# EAGLE design Relay ISOx16 (EAGLE 6.2)
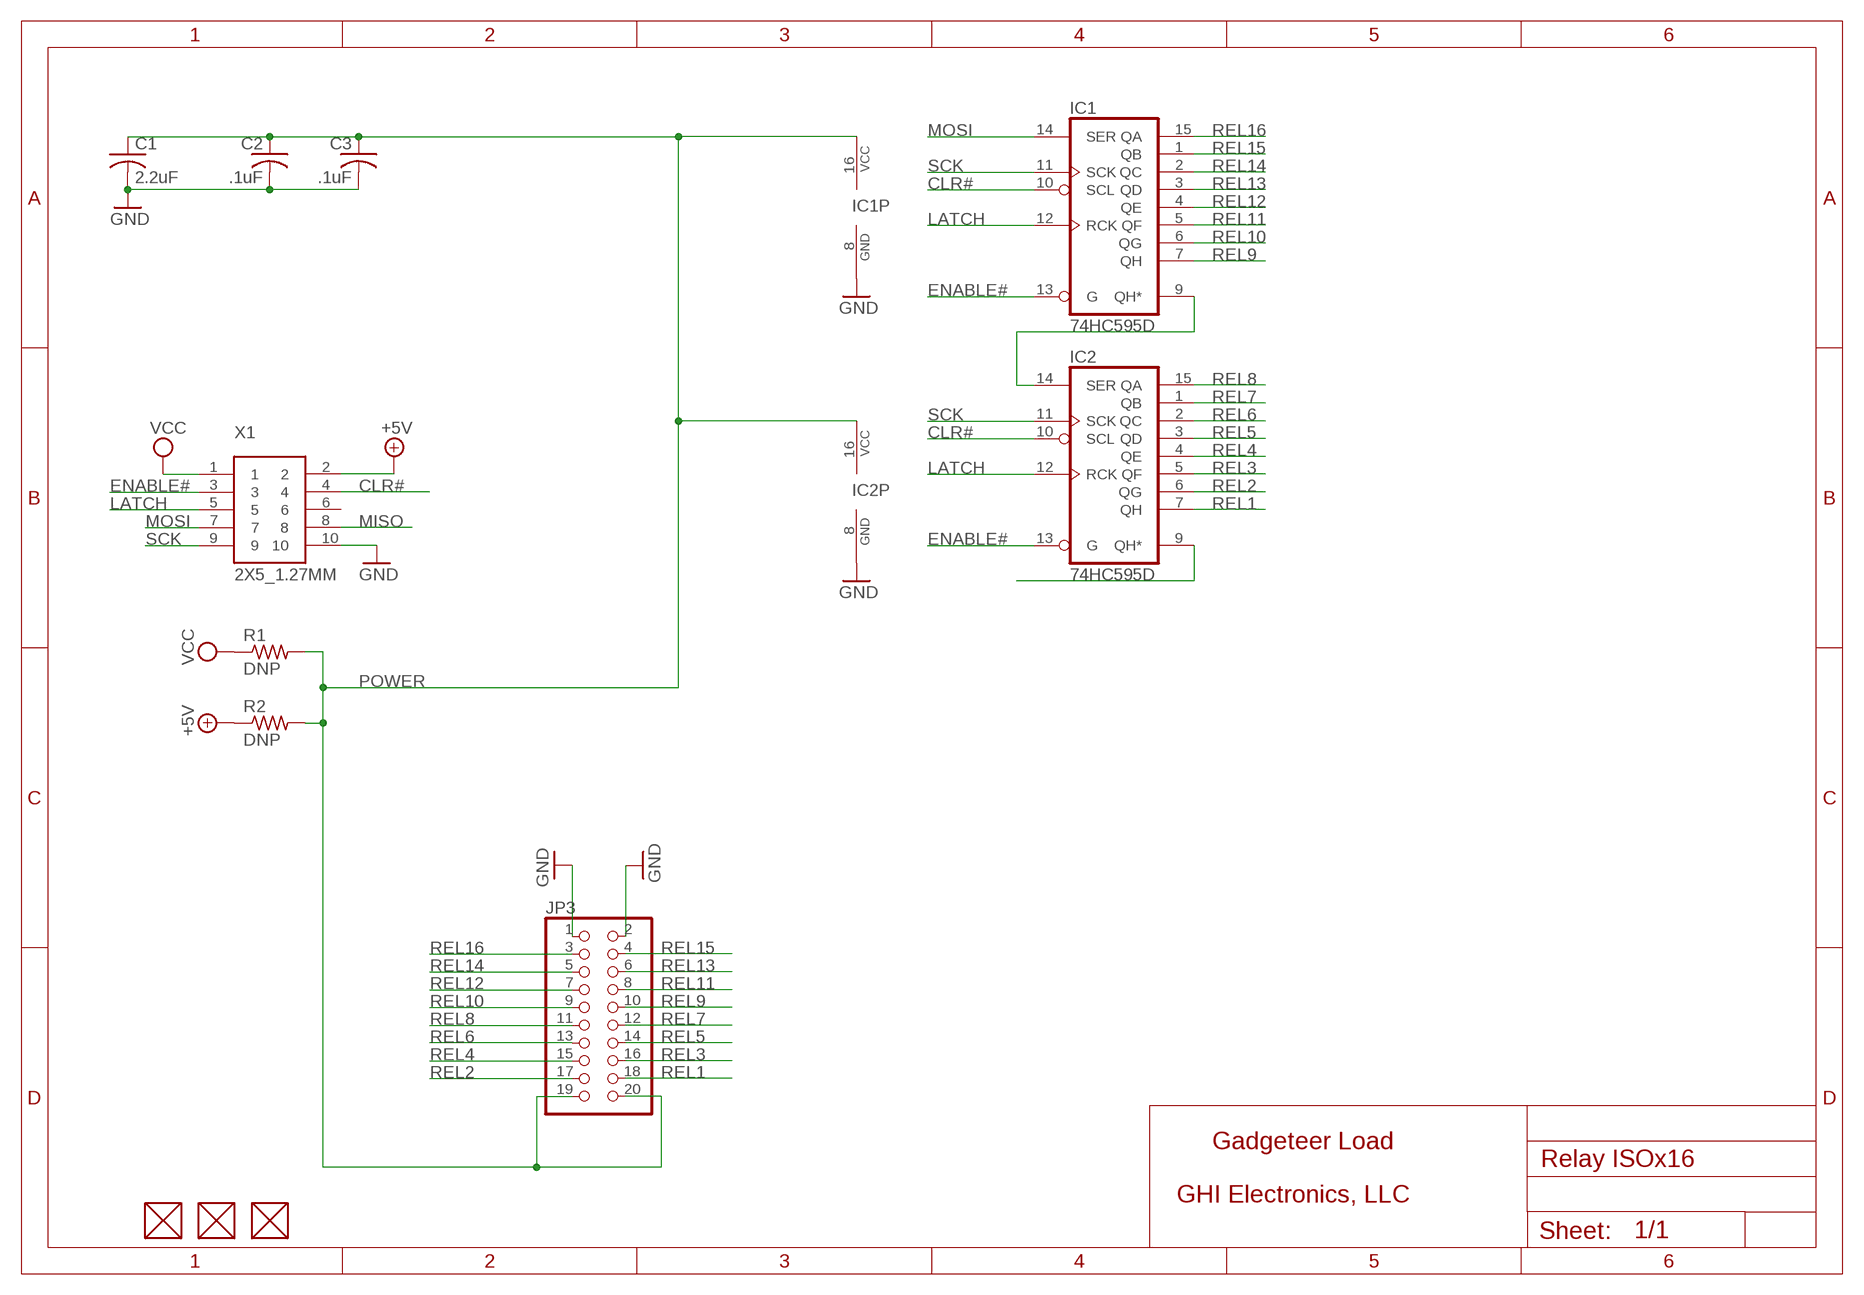
[diagram p0: schematic, sheet 1]

## Parts
C1  2.2uF  C-USC0805K  [C0805K]
C2  .1uF  C-USC0603K  [C0603K]
C3  .1uF  C-USC0603K  [C0603K]
FUD1  FIDUCIAL  [FIDUCIAL_40MIL]
FUD2  FIDUCIAL  [FIDUCIAL_40MIL]
FUD3  FIDUCIAL  [FIDUCIAL_40MIL]
IC1  74HC595D  74LS595D  [SO16]
IC2  74HC595D  74LS595D  [SO16]
JP3  PINHD-2X10  [2X10]
R1  DNP  R-US_R0603  [R0603]
R2  DNP  R-US_R0603  [R0603]
X1  2X5_1.27MM  [2X5_1.27MM]

## Nets
+5V [power]: R2.1 X1.2
CLR#: IC1.10(SCL) IC2.10(SCL) X1.4
ENABLE#: IC1.13(G) IC2.13(G) X1.3
GND [power]: C1.2 C2.2 C3.2 IC1.8(GND) IC2.8(GND) JP3.1 JP3.2 X1.10
LATCH: IC1.12(RCK) IC2.12(RCK) X1.5
MISO: X1.8
MOSI: IC1.14(SER) X1.7
N$24: IC1.9(QH*) IC2.14(SER)
N$25: IC2.9(QH*)
POWER: C1.1 C2.1 C3.1 IC1.16(VCC) IC2.16(VCC) JP3.19 JP3.20 R1.2 R2.2
REL1: IC2.7(QH) JP3.18
REL2: IC2.6(QG) JP3.17
REL3: IC2.5(QF) JP3.16
REL4: IC2.4(QE) JP3.15
REL5: IC2.3(QD) JP3.14
REL6: IC2.2(QC) JP3.13
REL7: IC2.1(QB) JP3.12
REL8: IC2.15(QA) JP3.11
REL9: IC1.7(QH) JP3.10
REL10: IC1.6(QG) JP3.9
REL11: IC1.5(QF) JP3.8
REL12: IC1.4(QE) JP3.7
REL13: IC1.3(QD) JP3.6
REL14: IC1.2(QC) JP3.5
REL15: IC1.1(QB) JP3.4
REL16: IC1.15(QA) JP3.3
SCK: IC1.11(SCK) IC2.11(SCK) X1.9
VCC [power]: R1.1 X1.1
Unconnected: FUD1.P$1 FUD2.P$1 FUD3.P$1 X1.6

## Notes on the sheet
- Gadgeteer Load
- GHI Electronics, LLC

## Library data of the parts
C1-C3 = rcl:C-US: CAPACITOR, American symbol
FUD1-FUD3 = GHI:FIDUCIAL
IC1 IC2 = 74xx-us:74*595: 8-bit SHIFT REGISTER, output latch
JP3 = pinhead:PINHD-2X10: PIN HEADER
R1 R2 = rcl:R-US_: RESISTOR, American symbol
X1 = GHI:2X5_1.27MM

## Board
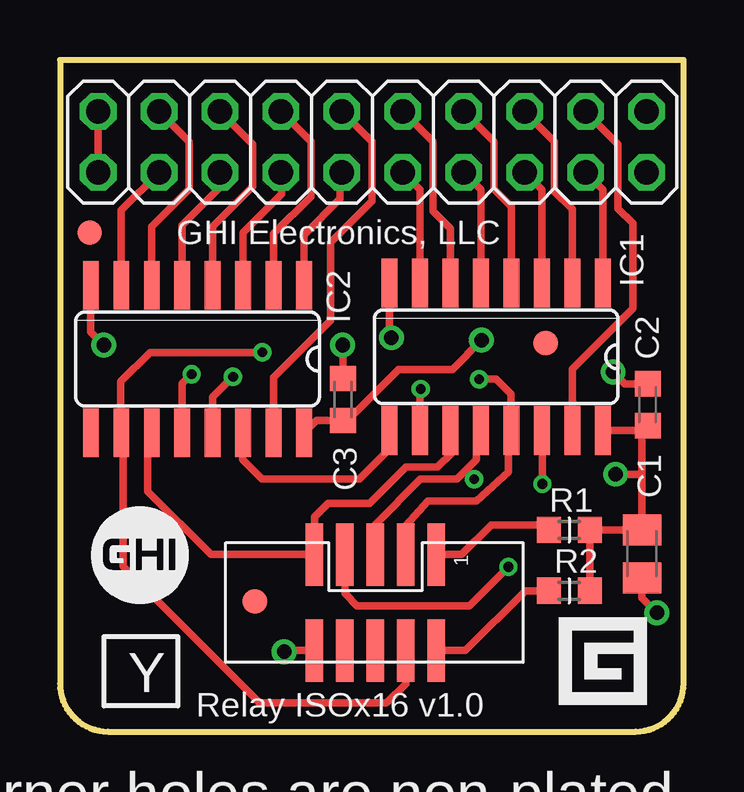
[diagram p1: board, top side]
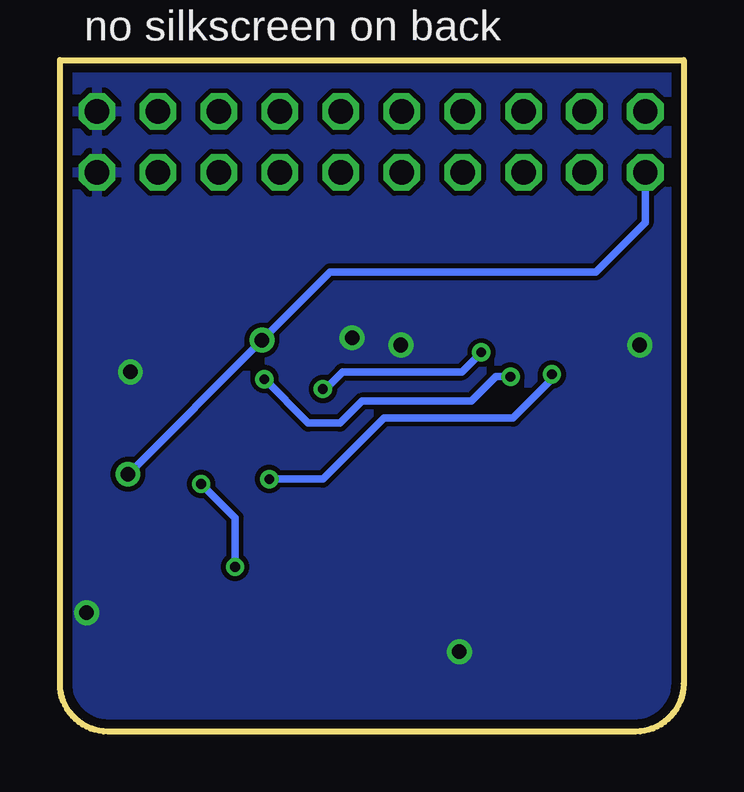
[diagram p2: board, bottom side, seen from below]

Size 26 x 28 mm. Coordinates in mm from the lower left corner, seen from the top.
Outline: 26,28 0,28 0,2 arc90 2,0 24,0 arc90 26,2 26,28
Copper layers (1+16): Top 0.035mm / dielectric 1.5mm / Bottom 0.035mm
Design rules: minimum track width 8mil, minimum drill 12mil, track to track 8mil, track to pad 8mil, pad to pad 8mil, via to via 8mil, smd to smd 8mil, copper to edge 15mil, drill to drill 8mil, minimum pad ring 10mil, minimum via ring 7mil, stop-mask expansion 4mil, vias tented up to drill 50mil, thermal gap 10mil

### Footprints (pad centres in the part's own frame; a part is rotated, then mirrored left to right if it is on the bottom)
C0805K = smd 1.3 x 1.6: 1 -1,0; 2 1,0
C0603K = smd 1.05 x 1.08: 1 -0.875,0; 2 0.875,0
FIDUCIAL_40MIL = smd 1.016 x 1.016: P$1 0,0
SO16 = smd 0.66 x 2.032: 1 -4.445,-3.073; 2 -3.175,-3.073; 3 -1.905,-3.073; 4 -0.635,-3.073; 5 0.635,-3.073; 6 1.905,-3.073; 7 3.175,-3.073; 8 4.445,-3.073; 9 4.445,3.073; 10 3.175,3.073; 11 1.905,3.073; 12 0.635,3.073; 13 -0.635,3.073; 14 -1.905,3.073; 15 -3.175,3.073; 16 -4.445,3.073
2X10 = drill 1.016 octagon: 1 -11.43,-1.27; 2 -11.43,1.27; 3 -8.89,-1.27; 4 -8.89,1.27; 5 -6.35,-1.27; 6 -6.35,1.27; 7 -3.81,-1.27; 8 -3.81,1.27; 9 -1.27,-1.27; 10 -1.27,1.27; 11 1.27,-1.27; 12 1.27,1.27; 13 3.81,-1.27; 14 3.81,1.27; 15 6.35,-1.27; 16 6.35,1.27; 17 8.89,-1.27; 18 8.89,1.27; 19 11.43,-1.27; 20 11.43,1.27
R0603 = smd 1 x 1.1: 1 -0.85,0; 2 0.85,0
2X5_1.27MM = smd 2.6 x 0.74: 1 -2,2.58; 2 2,2.58; 3 -2,1.31; 4 2,1.31; 5 -2,0.04; 6 2,0.04; 7 -2,-1.23; 8 2,-1.23; 9 -2,-2.5; 10 2,-2.5

### Placement (x,y rotation side)
C1  24.27,7.41 270 top
C2  24.5,13.62 90 top
C3  11.8,13.84 90 top
FUD1  20.25,16.19 270 top
FUD2  1.25,20.8 0 top
FUD3  8.12,5.43 0 top
IC1  18.19,15.63 180 top
IC2  5.74,15.53 180 top
JP3  13.02,24.58 180 top
R1  21.23,8.41 0 top
R2  21.23,5.87 0 top
X1  13.11,5.38 270 top

### Tracks (layer width: path | path; a pad name or v marks a point on that pad's centre or on a via)
+5V
  Top 0.305: X1.2 16.91,3.38 19.41,5.87 R2.1
CLR#  (via drill 0.41)
  Top 0.305: X1.4 14.42,2 13.61,1.19 8.33,1.19 2.64,6.88 2.64,12.38 IC2.10 2.54,12.48 2.54,14.59 3.76,15.81 v8.43,15.81 | IC1.10 15.01,14.26 v15.04,14.28
  Bottom 0.305: v15.04,14.28 14.94,14.28 14.22,14.99 9.25,14.99 v8.43,15.81
ENABLE#  (via drill 0.41)
  Top 0.305: X1.3 14.42,8.58 15.34,9.61 17.37,9.61 18.69,10.83 18.69,12.42 IC1.13 18.8,12.58 18.8,14.08 18.19,14.69 v17.48,14.69 | IC2.13 6.37,13.95 v7.21,14.79
  Bottom 0.305: v7.21,14.79 7.82,14.79 8.84,13.78 13.41,13.78 14.33,12.86 15.65,12.86 v17.48,14.69
GND  (via drill 0.61)
  Top 0.305: C1.2 24.27,5.58 v24.89,4.95 | C2.2 23.56,14.5 v23.06,14.99 | IC1.8 13.74,16.49 v13.82,16.42 | C3.2 11.8,15.79 v11.79,16.11 | X1.10 9.4,3.38 v9.35,3.33 | IC2.8 1.29,16.65 v1.83,16.11
  pour Bottom: 26.32,-0.07 26.32,27.9 -0.41,27.9 -0.41,-0.07
LATCH  (via drill 0.41)
  Top 0.305: X1.5 13.15,8.63 15.04,10.53 16.56,10.53 16.92,10.88 | 16.92,10.88 17.37,11.34 17.37,12.37 IC1.12 | IC2.12 5.1,14.51 v5.49,14.89 | v17.27,10.53 16.92,10.88
  Bottom 0.305: v5.49,14.89 5.49,14.69 7.11,13.06 12.5,13.06 15.04,10.53 v17.27,10.53
MOSI  (via drill 0.41)
  Top 0.305: X1.7 11.88,5.76 12.39,5.24 17.07,5.24 v18.69,6.87 | v20.12,10.32 20.12,12.53 IC1.14
  Bottom 0.305: v18.69,6.87 18.69,8.9 v20.12,10.32
N$24
  Top 0.305: IC1.9 13.74,11.77 12.5,10.53 8.43,10.53 7.62,11.34 7.62,12.44 IC2.14
POWER  (via drill 0.61)
  Top 0.305: R2.2 R1.2 24.17,8.41 C1.1 24.27,10.63 | IC1.16 24.31,12.55 C2.1 24.27,12.51 24.27,10.63 | IC2.16 10.69,12.97 C3.1 11.99,12.97 14.12,15.1 16.36,15.1 v17.58,16.32 | JP3.19 JP3.20 | v23.16,10.73 24.16,10.73 24.27,10.63
  Bottom 0.305: JP3.20 1.59,21.22 3.66,19.16 14.73,19.16 v17.58,16.32 v23.16,10.73
REL1
  Top 0.305: IC2.7 2.56,21.74 JP3.18
REL2
  Top 0.305: IC2.6 3.83,21.06 5.38,22.61 5.38,24.6 JP3.17
REL3
  Top 0.305: IC2.5 5.1,21.11 6.6,22.61 6.6,23.24 JP3.16
REL4
  Top 0.305: IC2.4 6.37,21.06 8.03,22.72 8.03,24.5 JP3.15
REL5
  Top 0.305: IC2.3 7.64,20.81 9.25,22.41 9.25,23.28 JP3.14
REL6
  Top 0.305: IC2.2 8.91,20.76 10.46,22.31 10.46,24.6 JP3.13
REL7
  Top 0.305: IC2.1 10.18,20.71 11.68,22.21 11.68,23.24 JP3.12
REL8
  Top 0.305: IC2.15 8.91,14.76 11.28,17.13 11.28,20.38 13.01,22.11 13.01,24.6 JP3.11
REL9
  Top 0.305: IC1.7 15.01,22.59 JP3.10
REL10
  Top 0.305: IC1.6 16.28,20.96 15.54,21.7 15.54,24.6 JP3.9
REL11
  Top 0.305: IC1.5 17.55,22.59 JP3.8
REL12
  Top 0.305: IC1.4 18.82,21.88 18.09,22.61 18.09,24.6 JP3.7
REL13
  Top 0.305: IC1.3 20.09,22.59 JP3.6
REL14
  Top 0.305: IC1.2 21.36,21.77 20.62,22.51 20.62,24.6 JP3.5
REL15
  Top 0.305: IC1.1 22.63,22.59 JP3.4
REL16
  Top 0.305: IC1.15 21.36,15.12 23.88,17.64 23.88,21.19 23.27,21.8 23.27,24.5 JP3.3
SCK
  Top 0.305: IC1.11 16.36,12.48 16.36,11.64 15.75,11.03 14.43,11.03 12.9,9.51 11.18,9.51 10.61,8.94 X1.9 6.3,7.38 3.66,10.02 3.66,12.28 IC2.11
VCC
  Top 0.305: X1.1 16.75,7.38 17.98,8.61 20.18,8.61 R1.1

### Text on the board
tPlace: GHI Electronics, LLC | Y | Relay ISOx16 v1.0 | Corner holes are non-plated | black PCB with white text | do not add manufacturing codes
bPlace: no silkscreen on back